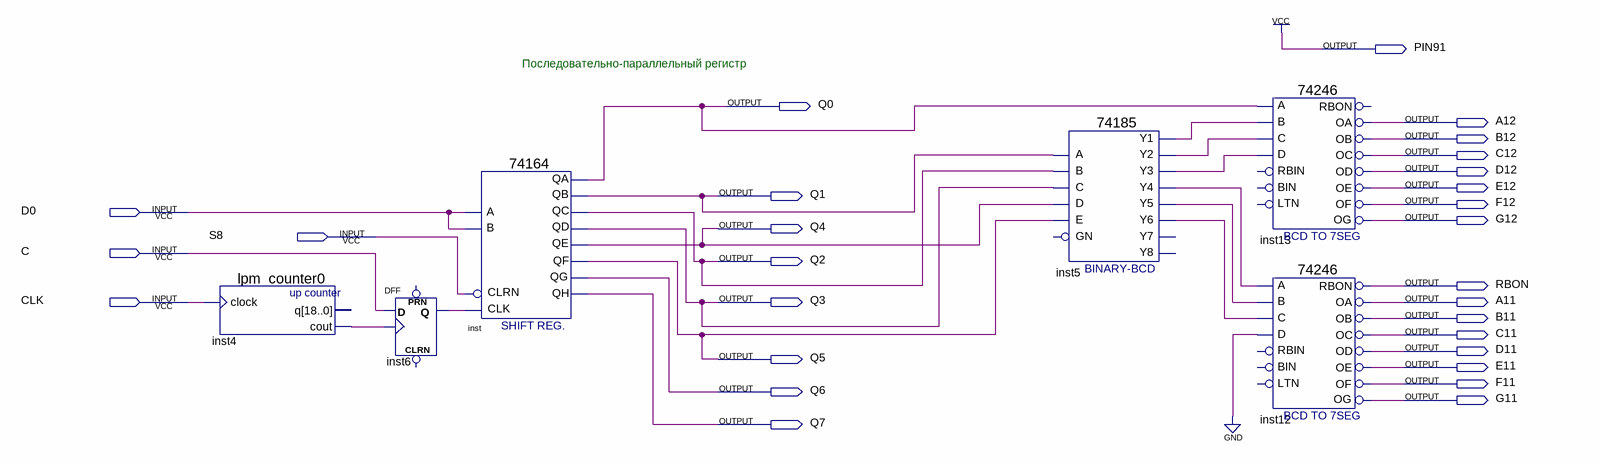
[diagram p0: schematic sheet]
// Quartus schematic project14_registers3.bdf as structural Verilog: 6 symbols, 28 pins
module project14_registers3 (
  input  D0,
  input  S8,
  input  C,
  input  CLK,
  output PIN91,
  output Q0,
  output A12,
  output B12,
  output C12,
  output D12,
  output E12,
  output Q1,
  output F12,
  output G12,
  output Q4,
  output Q2,
  output RBON,
  output Q3,
  output A11,
  output B11,
  output C11,
  output D11,
  output Q5,
  output E11,
  output F11,
  output Q6,
  output G11,
  output Q7
);

  wire inst4_cout, inst5_y1, inst5_y2, inst5_y3, inst5_y4, inst5_y5, inst5_y6, inst6_q;

  lpm_counter0 inst4 (.clock(CLK), .cout(inst4_cout));  // open: q
  DFF inst6 (.CLK(inst4_cout), .D(C), .Q(inst6_q));  // open: CLRN, PRN
  \74164  inst (
    .CLRN(S8), .CLK(inst6_q), .B(D0), .A(D0), .QD(Q3), .QC(Q2), .QA(Q0), .QF(Q5), .QH(Q7), .QG(Q6), .QE(Q4),
    .QB(Q1));
  \74185  inst5 (
    .A(Q1), .B(Q2), .D(Q4), .C(Q3), .E(Q5), .Y1(inst5_y1), .Y3(inst5_y3), .Y2(inst5_y2), .Y5(inst5_y5),
    .Y4(inst5_y4), .Y6(inst5_y6));  // open: GN, Y8, Y7
  \74246  inst13 (
    .B(inst5_y1), .A(Q0), .D(inst5_y3), .C(inst5_y2), .OD(D12), .OC(C12), .OB(B12), .OE(E12), .OF(F12),
    .OA(A12), .OG(G12));  // open: RBIN, LTN, BIN, RBON
  \74246  inst12 (
    .B(inst5_y5), .A(inst5_y4), .D(1'b0), .C(inst5_y6), .OD(D11), .RBON(RBON), .OC(C11), .OB(B11), .OE(E11),
    .OF(F11), .OA(A11), .OG(G11));  // open: RBIN, LTN, BIN

  assign PIN91 = 1'b1;

  // Notes on the sheet:
  //   Последовательно-параллельный регистр
endmodule
